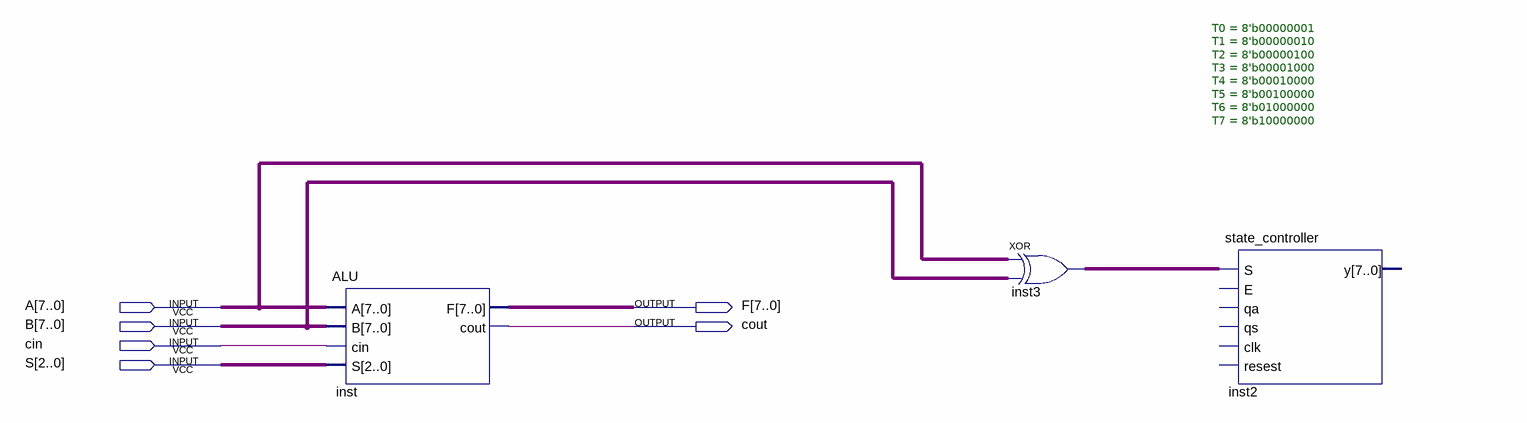
[diagram p0: schematic sheet]
// Quartus schematic Block1.bdf as structural Verilog: 3 symbols, 6 pins
module Block1 (
  input  [7:0] A,
  input  [7:0] B,
  input  cin,
  input  [2:0] S,
  output [7:0] F,
  output cout
);

  wire [7:0] inst3_out;

  ALU inst (.A(A), .B(B), .cin(cin), .S(S), .F(F), .cout(cout));
  assign inst3_out = A ^ B;  // XOR inst3, 8 bits wide
  state_controller #(.T0(8'b00000001), .T1(8'b00000010), .T2(8'b00000100), .T3(8'b00001000), .T4(8'b00010000), .T5(8'b00100000), .T6(8'b01000000), .T7(8'b10000000)) inst2 (.S(inst3_out));  // open: E, qa, qs, clk, resest, y
endmodule
